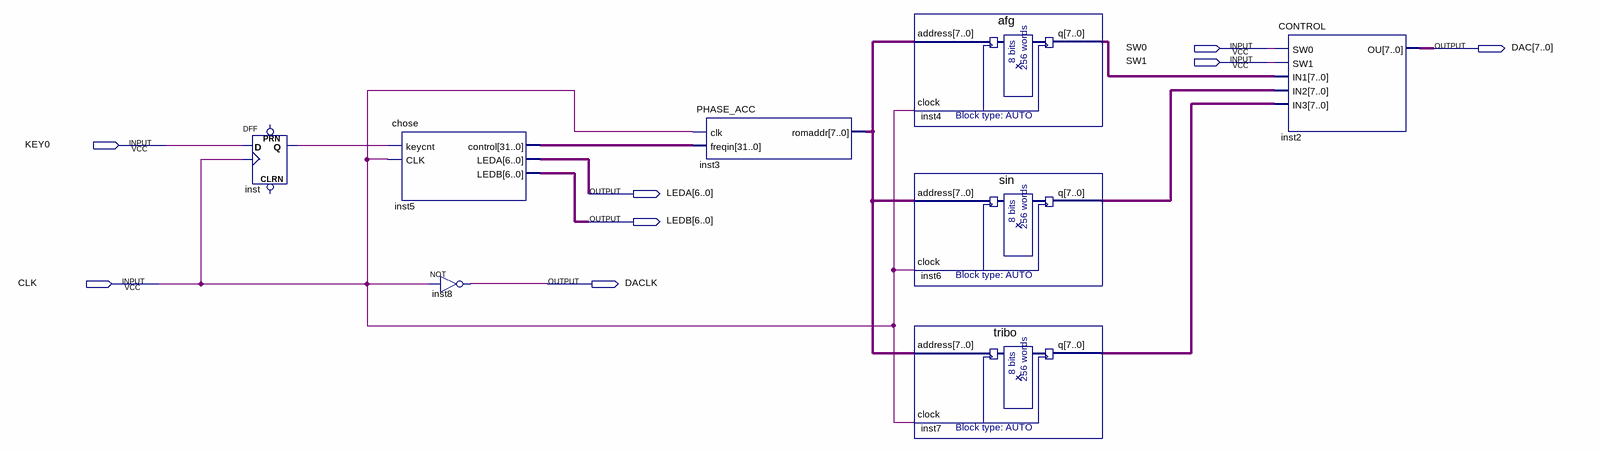
[diagram p0: schematic sheet]
// Quartus schematic add.bdf as structural Verilog: 8 symbols, 8 pins
module add (
  input  SW0,
  input  SW1,
  input  KEY0,
  input  CLK,
  output [7:0] DAC,
  output [6:0] LEDA,
  output [6:0] LEDB,
  output DACLK
);

  wire inst_q;
  wire [7:0] inst3_romaddr, inst4_q, inst6_q, inst7_q;
  wire [31:0] inst5_control;

  DFF inst (.CLK(CLK), .D(KEY0), .Q(inst_q));  // open: CLRN, PRN
  chose inst5 (.keycnt(inst_q), .CLK(CLK), .control(inst5_control), .LEDA(LEDA), .LEDB(LEDB));
  not inst8 (DACLK, CLK);
  PHASE_ACC inst3 (.clk(CLK), .freqin(inst5_control), .romaddr(inst3_romaddr));
  afg inst4 (.address(inst3_romaddr), .clock(CLK), .q(inst4_q));
  sin inst6 (.address(inst3_romaddr), .clock(CLK), .q(inst6_q));
  tribo inst7 (.address(inst3_romaddr), .clock(CLK), .q(inst7_q));
  CONTROL inst2 (.SW0(SW0), .SW1(SW1), .IN1(inst4_q), .IN2(inst6_q), .IN3(inst7_q), .OU(DAC));
endmodule
